# Altium project pLED.PrjPcb
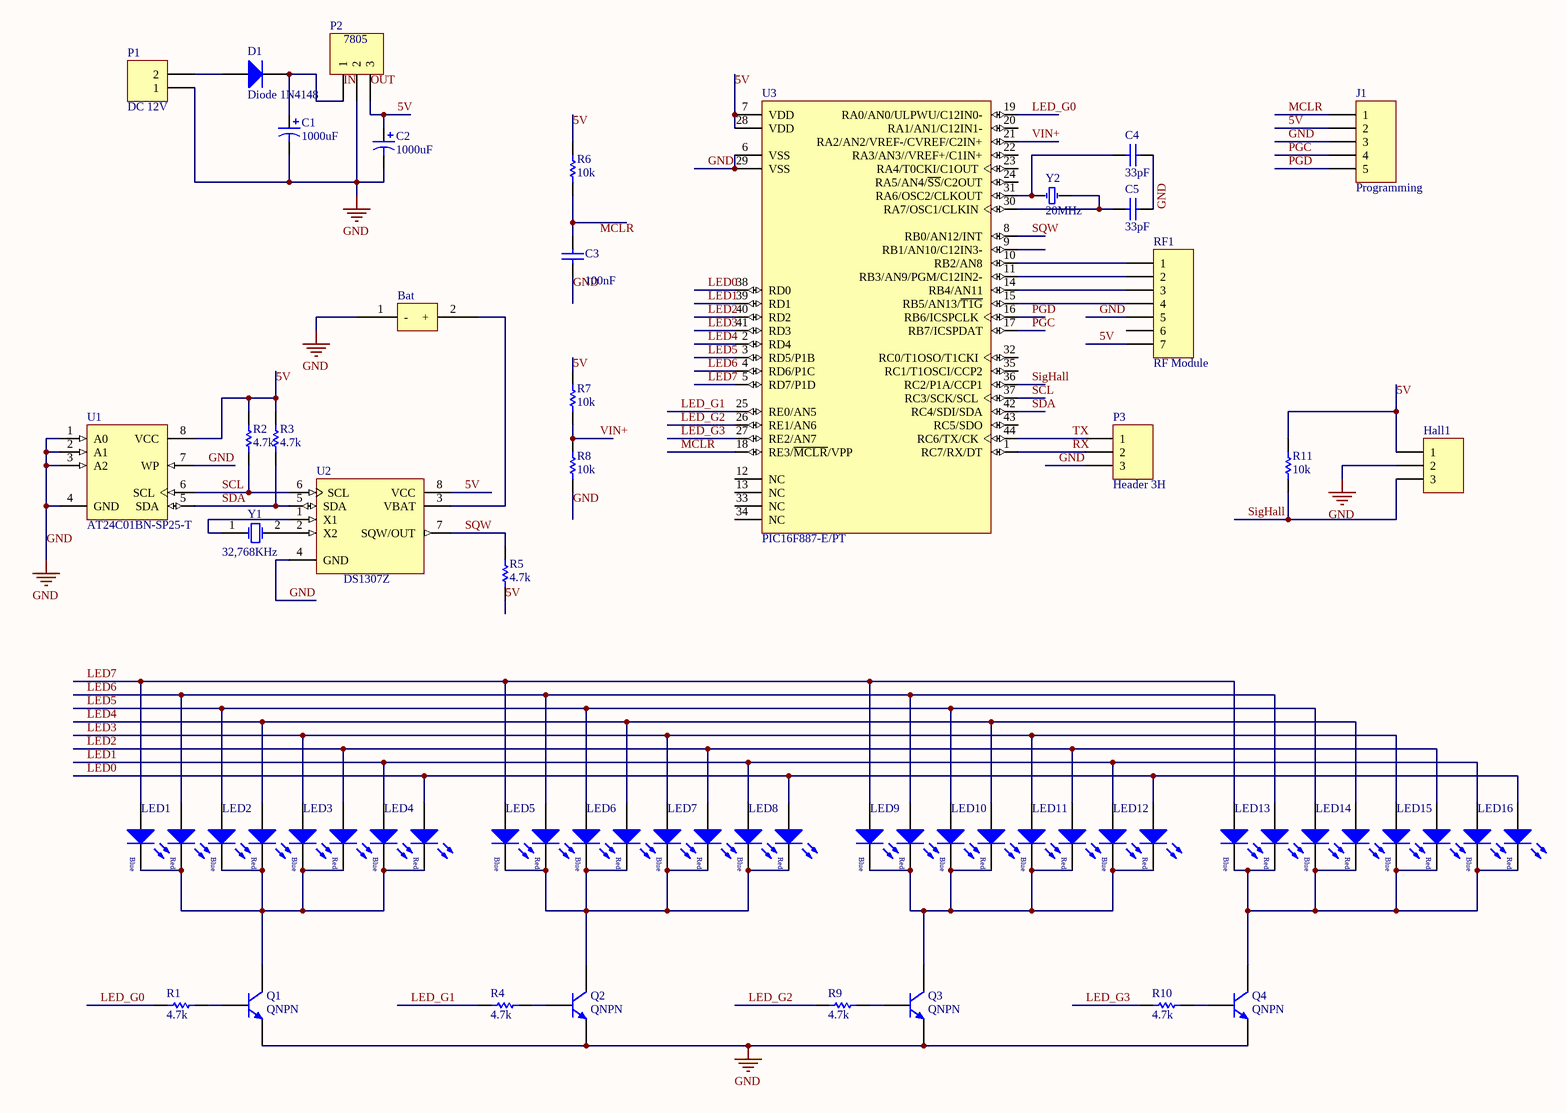
[diagram p0: SCH.SchDoc]
1 sheet, 49 parts. Net scope: global (net labels, ports and power ports of the same name join across sheets).
Board file: PCB.PcbDoc

## Sheet SCH.SchDoc
size A3

### Parts
Bat  Battery  [BATTERY]  (value not drawn)
C1  value 1000uF  [CAP POL 2]  (hidden comment: Cap Pol3)
C2  value 1000uF  [CAP POL 2]  (hidden comment: Cap Pol3)
C3  value 100nF  [SM/C_0805]  (hidden comment: Cap Semi)
C4  value 33pF  [SM/C_0805]  (hidden comment: Cap Semi)
C5  value 33pF  [SM/C_0805]  (hidden comment: Cap Semi)
D1  Diode 1N4148  [DO-35]
Hall1  Header 3  [HDR1X3]  (value not drawn)
J1  Programming  [HDR1X5H]
LED1  150141RB73100  [3528]  (value not drawn)
LED2  150141RB73100  [3528]  (value not drawn)
LED3  150141RB73100  [3528]  (value not drawn)
LED4  150141RB73100  [3528]  (value not drawn)
LED5  150141RB73100  [3528]  (value not drawn)
LED6  150141RB73100  [3528]  (value not drawn)
LED7  150141RB73100  [3528]  (value not drawn)
LED8  150141RB73100  [3528]  (value not drawn)
LED9  150141RB73100  [3528]  (value not drawn)
LED10  150141RB73100  [3528]  (value not drawn)
LED11  150141RB73100  [3528]  (value not drawn)
LED12  150141RB73100  [3528]  (value not drawn)
LED13  150141RB73100  [3528]  (value not drawn)
LED14  150141RB73100  [3528]  (value not drawn)
LED15  150141RB73100  [3528]  (value not drawn)
LED16  150141RB73100  [3528]  (value not drawn)
P1  DC 12V  [HDR1X2H]
P2  7805  [HDR1X3]
P3  Header 3H  [HDR1X3H]
Q1  QNPN  [SOT-23B_N]
Q2  QNPN  [SOT-23B_N]
Q3  QNPN  [SOT-23B_N]
Q4  QNPN  [SOT-23B_N]
R1  value 4.7k  [SM/C_0805]  (hidden comment: Res Semi)
R2  value 4.7k  [SM/C_0805]  (hidden comment: Res Semi)
R3  value 4.7k  [SM/C_0805]  (hidden comment: Res Semi)
R4  value 4.7k  [SM/C_0805]  (hidden comment: Res Semi)
R5  value 4.7k  [SM/C_0805]  (hidden comment: Res Semi)
R6  value 10k  [SM/C_0805]  (hidden comment: Res Semi)
R7  value 10k  [SM/C_0805]  (hidden comment: Res Semi)
R8  value 10k  [SM/C_0805]  (hidden comment: Res Semi)
R9  value 4.7k  [SM/C_0805]  (hidden comment: Res Semi)
R10  value 4.7k  [SM/C_0805]  (hidden comment: Res Semi)
R11  value 10k  [SM/C_0805]  (hidden comment: Res Semi)
RF1  RF Module  [HDR1X7]
U1  AT24C01BN-SP25-T  [8S1_N]
U2  DS1307Z  [SOIC8N_N]
U3  PIC16F887-E/PT  [TQFP-PT44_N]
Y1  32,768KHz  [CFPX-93]
Y2  20MHz  [CRYSTAL]

### Nets
GND: Bat.1(-) C1.2 C2.2 C3.1 C4.1 C5.1 Hall1.2 J1.3 P1.1 P2.2 P3.3 Q1.3(E) Q2.3(E) Q3.3(E) Q4.3(E) R8.1 RF1.5 U1.1(A0) U1.2(A1) U1.3(A2) U1.4(GND) U1.7(WP) U2.4(GND) U3.6(VSS) U3.29(VSS)
5V: C2.1 Hall1.1 J1.2 P2.3 R2.2 R3.2 R5.1 R6.2 R7.2 R11.2 RF1.7 U1.8(VCC) U2.8(VCC) U3.7(VDD) U3.28(VDD)
LED0: LED4.1(A) LED8.1(A) LED12.1(A) LED16.1(A) U3.38(RD0)
LED1: LED4.2(A) LED8.2(A) LED12.2(A) LED16.2(A) U3.39(RD1)
LED2: LED3.1(A) LED7.1(A) LED11.1(A) LED15.1(A) U3.40(RD2)
LED3: LED3.2(A) LED7.2(A) LED11.2(A) LED15.2(A) U3.41(RD3)
LED4: LED2.1(A) LED6.1(A) LED10.1(A) LED14.1(A) U3.2(RD4)
LED5: LED2.2(A) LED6.2(A) LED10.2(A) LED14.2(A) U3.3(RD5/P1B)
LED6: LED1.1(A) LED5.1(A) LED9.1(A) LED13.1(A) U3.4(RD6/P1C)
LED7: LED1.2(A) LED5.2(A) LED9.2(A) LED13.2(A) U3.5(RD7/P1D)
LED_G0: R1.2 U3.19(RA0/AN0/ULPWU/C12IN0-)
LED_G1: R4.2 U3.25(RE0/AN5)
LED_G2: R9.2 U3.26(RE1/AN6)
LED_G3: R10.2 U3.27(RE2/AN7)
MCLR: J1.1 U3.18(RE3/~{MCLR}/VPP)
PGC: J1.4 U3.17(RB7/ICSPDAT)
PGD: J1.5 U3.16(RB6/ICSPCLK)
RX: P3.2 U3.1(RC7/RX/DT)
SCL: R2.1 U1.6(SCL) U2.6(SCL) U3.37(RC3/SCK/SCL)
SDA: R3.1 U1.5(SDA) U2.5(SDA) U3.42(RC4/SDI/SDA)
SigHall: Hall1.3 R11.1 U3.36(RC2/P1A/CCP1)
SQW: R5.2 U2.7(SQW/OUT) U3.8(RB0/AN12/INT)
TX: P3.1 U3.44(RC6/TX/CK)
VIN+: R7.1 R8.2 U3.21(RA2/AN2/VREF-/CVREF/C2IN+)
NetBat_2: Bat.2(+) U2.3(VBAT)
NetC1_1: C1.1 D1.2(K) P2.1
NetC3_2: C3.2 R6.1
NetC4_2: C4.2 U3.31(RA6/OSC2/CLKOUT) Y2.1
NetC5_2: C5.2 U3.30(RA7/OSC1/CLKIN) Y2.2
NetD1_1: D1.1(A) P1.2
NetLED1_3: LED1.3(C) LED1.4(C) LED2.3(C) LED2.4(C) LED3.3(C) LED3.4(C) LED4.3(C) LED4.4(C) Q1.1(C)
NetLED5_3: LED5.3(C) LED5.4(C) LED6.3(C) LED6.4(C) LED7.3(C) LED7.4(C) LED8.3(C) LED8.4(C) Q2.1(C)
NetLED9_3: LED9.3(C) LED9.4(C) LED10.3(C) LED10.4(C) LED11.3(C) LED11.4(C) LED12.3(C) LED12.4(C) Q3.1(C)
NetLED13_3: LED13.3(C) LED13.4(C) LED14.3(C) LED14.4(C) LED15.3(C) LED15.4(C) LED16.3(C) LED16.4(C) Q4.1(C)
NetQ1_2: Q1.2(B) R1.1
NetQ2_2: Q2.2(B) R4.1
NetQ3_2: Q3.2(B) R9.1
NetQ4_2: Q4.2(B) R10.1
NetRF1_1: RF1.1 U3.10(RB2/AN8)
NetRF1_2: RF1.2 U3.11(RB3/AN9/PGM/C12IN2-)
NetRF1_3: RF1.3 U3.14(RB4/AN11)
NetRF1_4: RF1.4 U3.15(RB5/AN13/~{T1G})
NetU2_1: U2.1(X1) Y1.1(OSC1)
NetU2_2: U2.2(X2) Y1.2(OSC2)

Not connected (* = marked no-connect by the designer): RF1 6; U3 9(RB1/AN10/C12IN3-) 12(NC) 13(NC) 20(RA1/AN1/C12IN1-) 22(RA3/AN3//VREF+/C1IN+) 23(RA4/T0CKI/C1OUT) 24(RA5/AN4/~{SS}/C2OUT) 32(RC0/T1OSO/T1CKI) 33(NC) 34(NC) 35(RC1/T1OSCI/CCP2) 43(RC5/SDO)

### Notes on the sheet
- Labels drawn without touching a wire or pin: IN, MCLR, OUT
- Title
- Size:
- Date:
- A3
- Number:
- Time:
- Revision:
- Sheet
- of
- File:
- (in symbol WL-SBTW 3528 150141RB73100) Blue; Red

### Library data of the parts
C1 C2 = Cap Pol3: Polarized Capacitor (Surface Mount); Published: 8-Jun-2000; LatestRevisionDate: 29-May-2009; LatestRevisionNote: IPC-7351 Footprint Added.; PackageReference: C0805; Publisher: Altium Limited; PackageDescription: Chip Capacitor
C3-C5 = Cap Semi: Capacitor (Semiconductor SIM Model); Published: 8-Jun-2000; LatestRevisionDate: 29-May-2009; LatestRevisionNote: IPC-7351 Footprint Added.; PackageReference: C1206; Publisher: Altium Limited; PackageDescription: Chip Capacitor
D1 = Diode 1N4148: High Conductance Fast Diode; Published: 8-Jun-2000; LatestRevisionDate: 17-Jul-2002; LatestRevisionNote: Re-released for DXP Platform.; DatasheetVersion: 1997; PackageReference: DO-35; Publisher: Altium Limited; PackageDescription: Diode, Axial; Body 3.8 x 1.9 mm (LxDia. max), Lead Dia. 0.53 mm (max); Code_JEDEC: DO-204-AH; ComponentLink1Description: Manufacturer Link; ComponentLink1URL: http://www.fairchildsemi.com/; ComponentLink2Description: Datasheet; ComponentLink2URL: http://www.fairchildsemi.com/ds/1N%2F1N4148.pdf
Hall1 P2 = Header 3: Header, 3-Pin; LatestRevisionDate: 17-Jul-2002; LatestRevisionNote: Re-released for DXP Platform.; Publisher: Altium Limited
J1 = Header 5H: Header, 5-Pin, Right Angle; LatestRevisionDate: 17-Jul-2002; LatestRevisionNote: Re-released for DXP Platform.; Publisher: Altium Limited
LED1-LED16 = WL-SBTW 3528 150141RB73100: SMD Bi-Color Top LED, WL-SBTW, Red & Blue; Manufacturer: Würth Elektronik eiSos GmbH; PartNo: 150141RB73100; ComponentLink1Description: Manufacturer; ComponentLink1URL: http://www.we-online.de; Created by: Christin Otto; Created Date: June 2013; ComponentLink2Description: Datasheet; ComponentLink2URL: http://katalog.we-online.com/led/datasheet/150141RB73100.pdf; Color: Red & Blue
P1 = Header 2H: Header, 2-Pin, Right Angle; LatestRevisionDate: 17-Jul-2002; LatestRevisionNote: Re-released for DXP Platform.; Publisher: Altium Limited
P3 = Header 3H: Header, 3-Pin, Right Angle; LatestRevisionDate: 17-Jul-2002; LatestRevisionNote: Re-released for DXP Platform.; Publisher: Altium Limited
Q1-Q4 = QNPN: NPN Bipolar Transistor; Published: 8-Jun-2000; LatestRevisionDate: 29-May-2009; LatestRevisionNote: IPC-7351 Footprint Added.; PackageVersion: Aug-1999; PackageReference: SOT-23B; Publisher: Altium Limited; PackageDescription: 3-Pin SOT-23 Package 0.95 mm Pitch, 2.4 mm Lead Span
R1-R11 = Res Semi: Semiconductor Resistor; Published: 8-Jun-2000; LatestRevisionDate: 17-Jul-2002; LatestRevisionNote: Re-released for DXP Platform.; PackageReference: AXIAL-0.5; Publisher: Altium Limited
RF1 = Header 7: Header, 7-Pin; LatestRevisionDate: 17-Jul-2002; LatestRevisionNote: Re-released for DXP Platform.; Publisher: Altium Limited
U1 = AT24C01BN-SP25-T: 1Kbit (128 x 8), 2-wire Bus Automotive Serial EEPROM with Write Protect, 2.5V, 8-Pin SOIC, Tape & Reel; Published: 20-Sep-2010; DatasheetVersion: 8517C,  Jan-2009; PackageVersion: revC, Mar-2005; PackageReference: 8S1; Publisher: Altium Limited; PackageDescription: 8-Lead (0.150" Wide Body), Plastic Gull Wing Small Outline (JEDEC SOIC); Code_JEDEC: MS-012-AA; Code_IPC: SOIC127P600-8; ComponentLink1Description: Manufacturer Link; ComponentLink1URL: http://www.atmel.com/products/serial/default.asp; ComponentLink2Description: Datasheet; ComponentLink2URL: http://www.atmel.com/dyn/resources/prod_documents/doc8517.pdf; ComponentLink3Description: Atmel.com Home; ComponentLink3URL: http://www.atmel.com
U2 = DS1307Z: 64 X 8 Serial Real-Time Clock; Published: 13-Oct-2000; LatestRevisionDate: 13-Apr-2006; LatestRevisionNote: IPC-7351 Footprint Added.; DatasheetVersion: 10-Aug-1999; PackageVersion: 1999; PackageReference: SOIC8N; Publisher: Altium Limited; PackageDescription: 8-Pin Small Outline Integrated Circuit 1.27 mm Pitch; Code_IPC: SOIC127P600-8; ComponentLink1Description: Manufacturer Link; ComponentLink1URL: http://www.maxim-ic.com/; ComponentLink2Description: Datasheet; ComponentLink2URL: http://pdfserv.maxim-ic.com/en/ds/DS1307.pdf; ComponentLink3Description: Discontinuation Notice; ComponentLink3URL: http://www.maxim-ic.com/qa/pdfs/non-obsolescence-letter.pdf
U3 = PIC16F887-E/PT: Flash-Based, 8-Bit CMOS Microcontroller with nanoWatt Technology, 8K (x14-Bit words) Program Memory, 624 Bytes Data Memory, 35 I/O pins, 44-Pin TQFP, Standard VDD Range, Extended Temperature; Published: 29-Jan-2009; LatestRevisionDate: 02-Dec-2009; LatestRevisionNote: Updated datasheet to version revF, Apr-2009.; DatasheetVersion: revF, Apr-2009; PackageVersion: revBB, Aug-2009; PackageReference: TQFP-PT44; Publisher: Altium Limited; PackageDescription: 44-Lead Plastic Thin Quad Flatpack (PT) - 10x10x1mm Body, 2.00mm [TQFP]; Supplier 1: Digi-Key; Supplier Part Number 1: PIC16F887-E/PT-ND; Supplier 2: Farnell; Supplier Part Number 2: 1579592; Code_JEDEC: MS-026; ComponentLink1Description: Datasheet; ComponentLink1URL: http://ww1.microchip.com/downloads/en/DeviceDoc/41291F.pdf; ComponentLink2Description: Packaging Specification; ComponentLink2URL: http://www.microchip.com/stellent/groups/techpub_sg/documents/packagingspec/en012702.pdf; ComponentLink3Description: Microchip.com Home; ComponentLink3URL: http://www.microchip.com/
Y1 = CFPX-93: Surface Mount Quartz Crystal; Note: PCB layout complies with manufacturer's recommendation.; Published: 17-Jul-2002; DatasheetDocument: 9-Sep-1999; PackageDocument: 9-Sep-1999; PackageReference: CFPX-93; Publisher: Altium Limited; ComponentLink1Description: Manufacturer Link; ComponentLink1URL: http://www.cmac.com/mt/
Y2 = XTAL